# Altium schematic sheet mcu.SchDoc
size A4
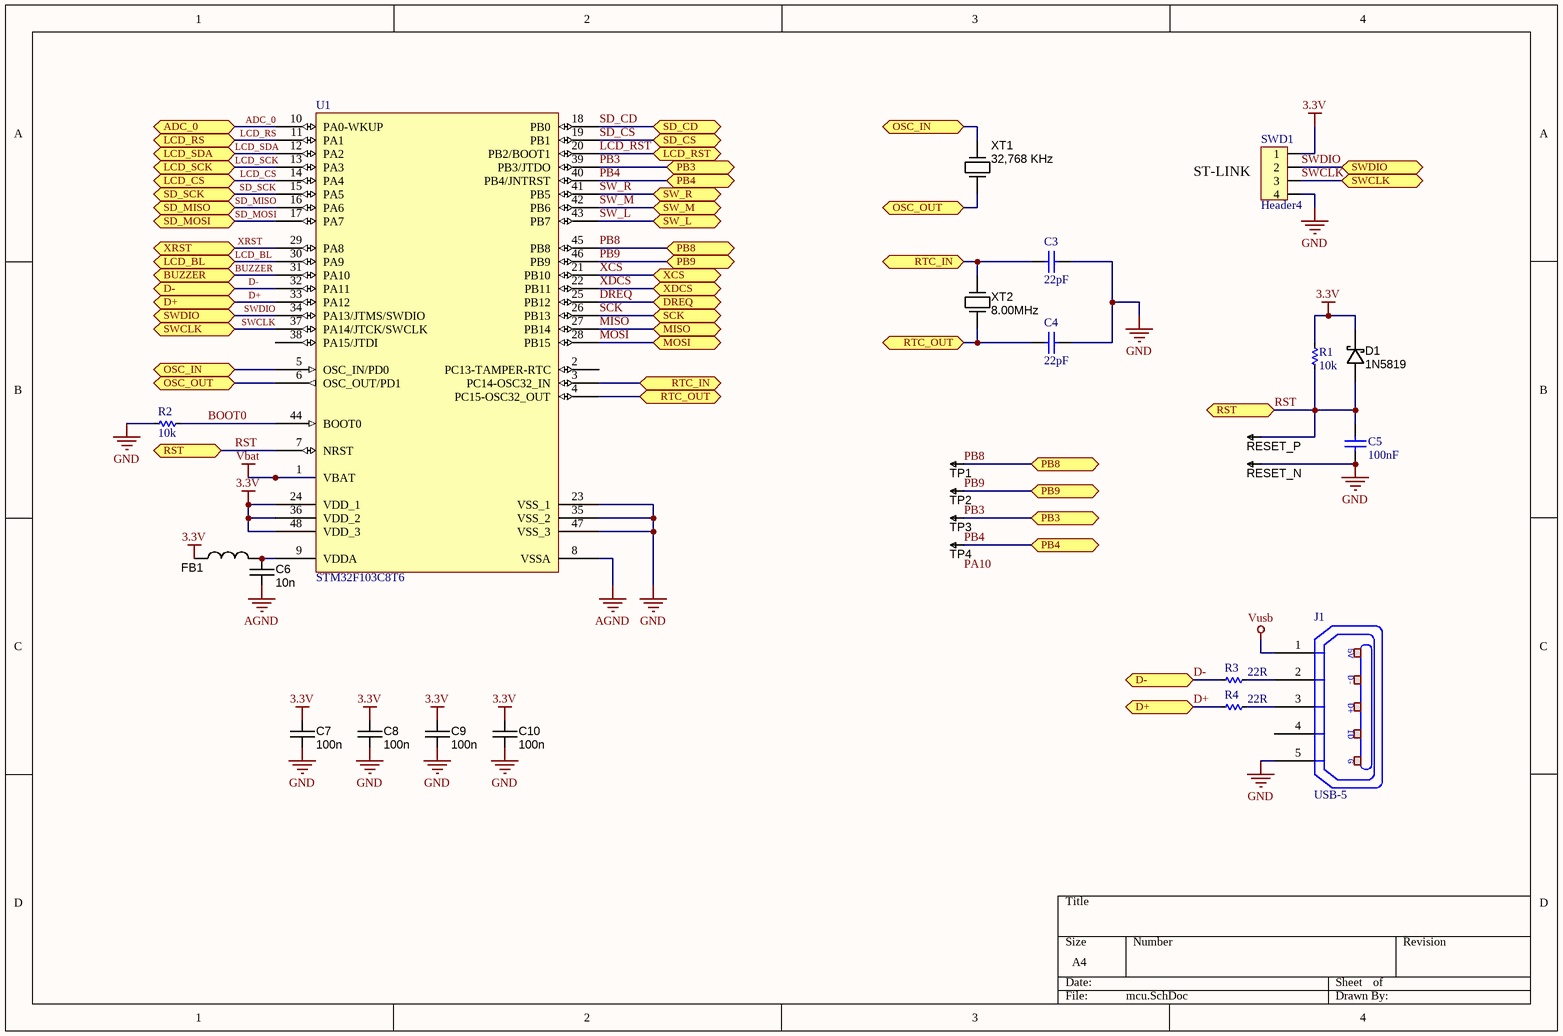
[diagram p0: mcu.SchDoc]

## Parts
C3  value 22pF  [C0805]  (hidden comment: Cap Semi)
C4  value 22pF  [C0805]  (hidden comment: Cap Semi)
C5  value 100nF  [C0805]  (hidden comment: Cap Semi)
C6  value 10n  [CAPC1608X90N]  (hidden comment: approved sub OK)
C7  value 100n  [CAPC1608X90N]  (hidden comment: approved sub OK)
C8  value 100n  [CAPC1608X90N]  (hidden comment: approved sub OK)
C9  value 100n  [CAPC1608X90N]  (hidden comment: approved sub OK)
C10  value 100n  [CAPC1608X90N]  (hidden comment: approved sub OK)
D1  Manufacturer Part Number 1: 1N5819  [SOD123]  (hidden comment: DIODE_SCHOTTKY_40V_1A)
FB1  2K2 @ 100 MHz  [FBC2012N]  (value not drawn)
J1  USB-5  [USB-M1]
R1  value 10k  [RES-SMD-0805]  (hidden comment: Res)
R2  value 10k  [RES-SMD-0603]  (hidden comment: Res)
R3  value 22R  [RES-SMD-0603]  (hidden comment: Res)
R4  value 22R  [RES-SMD-0603]  (hidden comment: Res)
RESET_N  TESTPOINT  [TP-R60]  (value not drawn)  (no BOM)
RESET_P  TESTPOINT  [TP-R60]  (value not drawn)  (no BOM)
SWD1  Header4  [HDR4]
TP1  TESTPOINT  [TP-R60]  (value not drawn)  (no BOM)
TP2  TESTPOINT  [TP-R60]  (value not drawn)  (no BOM)
TP3  TESTPOINT  [TP-R60]  (value not drawn)  (no BOM)
TP4  TESTPOINT  [TP-R60]  (value not drawn)  (no BOM)
U1  STM32F103C8T6  [LQFP48_N]
XT1  32,768 KHz  [CRYSTAL_CMR309T]
XT2  8.00MHz  [CRYSTAL_HC49-US-SM]

## Ports
ADC_0, BUZZER, D+, D-, DREQ, LCD_BL, LCD_CS, LCD_RS, LCD_RST, LCD_SCK, LCD_SDA, MISO, MOSI, OSC_IN, OSC_OUT, PB3, PB4, PB8, PB9, RST, RTC_IN, RTC_OUT, SCK, SD_CD, SD_CS, SD_MISO, SD_MOSI, SD_SCK, SW_L, SW_M, SW_R, SWCLK, SWDIO, XCS, XDCS, XRST

## Nets
3.3V: C7.1 C8.1 C9.1 C10.1 D1.K FB1.1 R1.1 SWD1.1 U1.24(VDD_1) U1.36(VDD_2) U1.48(VDD_3)
AGND: C6.2 U1.8(VSSA)
GND: C3.1 C4.1 C5.1 C7.2 C8.2 C9.2 C10.2 J1.5(P5) R2.2 RESET_N.1 SWD1.4 U1.23(VSS_1) U1.35(VSS_2) U1.47(VSS_3)
Vbat: U1.1(VBAT)
Vusb: J1.1(P1)
ADC_0: U1.10(PA0-WKUP) ; port ADC_0
BOOT0: R2.1 U1.44(BOOT0)
BUZZER: U1.31(PA10) ; port BUZZER
D+: R4.2 U1.33(PA12) ; port D+
D-: R3.2 U1.32(PA11) ; port D-
DREQ: U1.25(PB12) ; port DREQ
LCD_BL: U1.30(PA9) ; port LCD_BL
LCD_CS: U1.14(PA4) ; port LCD_CS
LCD_RS: U1.11(PA1) ; port LCD_RS
LCD_RST: U1.20(PB2/BOOT1) ; port LCD_RST
LCD_SCK: U1.13(PA3) ; port LCD_SCK
LCD_SDA: U1.12(PA2) ; port LCD_SDA
MISO: U1.27(PB14) ; port MISO
MOSI: U1.28(PB15) ; port MOSI
OSC_IN: U1.5(OSC_IN/PD0) XT1.2(OUT) ; port OSC_IN
OSC_OUT: U1.6(OSC_OUT/PD1) XT1.1(IN) ; port OSC_OUT
PB3: TP3.1 U1.39(PB3/JTDO) ; port PB3
PB4: TP4.1 U1.40(PB4/JNTRST) ; port PB4
PB8: TP1.1 U1.45(PB8) ; port PB8
PB9: TP2.1 U1.46(PB9) ; port PB9
RST: C5.2 D1.A R1.2 RESET_P.1 U1.7(NRST) ; port RST
RTC_IN: C3.2 U1.3(PC14-OSC32_IN) XT2.2(OUT) ; port RTC_IN
RTC_OUT: C4.2 U1.4(PC15-OSC32_OUT) XT2.1(IN) ; port RTC_OUT
SCK: U1.26(PB13) ; port SCK
SD_CD: U1.18(PB0) ; port SD_CD
SD_CS: U1.19(PB1) ; port SD_CS
SD_MISO: U1.16(PA6) ; port SD_MISO
SD_MOSI: U1.17(PA7) ; port SD_MOSI
SD_SCK: U1.15(PA5) ; port SD_SCK
SW_L: U1.43(PB7) ; port SW_L
SW_M: U1.42(PB6) ; port SW_M
SW_R: U1.41(PB5) ; port SW_R
SWCLK: SWD1.3 U1.37(PA14/JTCK/SWCLK) ; port SWCLK
SWDIO: SWD1.2 U1.34(PA13/JTMS/SWDIO) ; port SWDIO
XCS: U1.21(PB10) ; port XCS
XDCS: U1.22(PB11) ; port XDCS
XRST: U1.29(PA8) ; port XRST
NetC6_1: C6.1 FB1.2 U1.9(VDDA)
NetJ1_2: J1.2(P2) R3.1
NetJ1_3: J1.3(P3) R4.1

Not connected (* = marked no-connect by the designer): J1 4(P4); U1 2(PC13-TAMPER-RTC) 38(PA15/JTDI)

## Notes on the sheet
- (near SWD1) ST-LINK
- Labels drawn without touching a wire or pin: PA10
- (in symbol USB-5) 5V; D-; D+; ID; G

## Library data of the parts
C3-C5 = Cap Semi: Capacitor (Semiconductor SIM Model); Published: 8-Jun-2000; LatestRevisionDate: 29-May-2009; LatestRevisionNote: IPC-7351 Footprint Added.; PackageReference: C1206; Publisher: Altium Limited; PackageDescription: Chip Capacitor
C6-C10 = CAPC_100n_0603_X7R_50V_10%: Capacitor SMD Cer 100nF 10% 50V X7R 0603; Manufacturer 1: AVX Corporation; Manufacturer Part Number 1: 06035C104KAT2A; Ratings: 50V; X7R; Material: ceramic; SCDType: spec; Manufacturer 2: TDK Corporation; Manufacturer Part Number 2: C1608X7R1H104K; Package / Case: 0603 (1608 Metric); Tolerance: ±10%; Supplier 1: Digi-Key; Supplier Part Number 1: 478-5052-1-ND; ComponentLink1URL: http://www.avx.com/docs/Catalogs/cx7r.pdf; ComponentLink1Description: http://www.avx.com/docs/Catalogs/cx7r.pdf; Supplier 2: Digi-Key; Supplier Part Number 2: 445-1314-1-ND; ComponentLink2URL: http://product.tdk.com/capacitor/mlcc/en/documents/mlcc_commercial_general_en.pdf; ComponentLink2Description: http://product.tdk.com/capacitor/mlcc/en/documents/mlcc_commercial_general_en.pdf
D1 = DIODE_SCHOTTKY_40V_1A: Diode Schottky SMD 40V 1A SOD123; Manufacturer 1: Diodes Inc; Ratings: 40V; 1A; Material: Si; SCDType: spec; Package / Case: SOD123; Diode Type: Schottky; Mounting Type: Surface Mount; Supplier 1: Digi-Key; Supplier Part Number 1: 1N5819HW-FDICT-ND
FB1 = FERRITE_2K2-100MHz_0805: Ferrite bead 2.2K Ohm at 100 MHz 200mA 0805 SMD; Manufacturer 1: Laird-Signal Integrity Products; Manufacturer Part Number 1: HZ0805B222R-10; Ratings: 200 mA; 800 mOhm DC; Impedance @ Frequency: 600 Ohm @ 100MHz; DC Resistance (DCR): 800 mOhm Max; Filter Type: Differential Mode - Single; SCDType: source; Size / Dimension: 0.063" L x 0.031" W (1.60mm x 0.80mm); Current Rating: 200mA; Package / Case: 0805 (2012 Metric); Height (Max): 0.043" (1.09mm); ComponentLink1URL: http://www.lairdtech.com/WorkArea/linkit.aspx?LinkIdentifier=id&ItemID=4879; ComponentLink1Description: http://www.lairdtech.com/WorkArea/linkit.aspx?LinkIdentifier=id&ItemID=4879; Supplier 1: Digi-Key; Supplier Part Number 1: 240-2562-1-ND; Mounting Type: Surface Mount; Value: 2K2 @ 100 MHz
J1 = USB-5: Manufacturer: FCI; Manufacturer Part Number: 10118193-0001LF; Connector Type: USB - micro B; Number of Contacts: 5; Gender: Receptacle; Specifications: USB 2.0; .Creator: MM; .Checked PCB: RF; Supplier 1: Digi-Key; RoHS: RoHS Compliant; Category: Connectors, Interconnects; Stock 1: 28642; Pricing 1: 1=0.46, 10=0.433, 25=0.3712, 50=0.3156, 100=0.3032, 250=0.27224, 500=0.25988 (USD); Packaging: Cut Tape (CT); Mounting Type: Surface Mount, Right Angle, Horizontal; Features: Shielded, Solder Retention; Ingress Protection: -; ComponentLink1URL: http://portal.fciconnect.com/Comergent//fci/drawing/10118193.pdf; ComponentLink1Description: http://portal.fciconnect.com/Comergent//fci/drawing/10118193.pdf; Supplier Part Number 1: 609-4616-1-ND; .Checked SCH: MM
R1-R4 = Res-SMD: Resistor; Manufacturer: Generic Components; Class: Passive; Published: 08/06/2000; Publisher: Altium Hobart Technology Centre
RESET_N RESET_P TP1-TP4 = TESTPOINT: SMD test pin
SWD1 = Header4: Header IDC, 4 x 1 Pin Vertical 2.54mm Pitch (Non-Boxed, Male); Manufacturer: W¨¹rth Elektronik eiSos GmbH; partNo: 613002143121; ComponentLink1 Description: Manufacturer; ComponentLink2 Description: Datasheet; NoPins: 02; Created Date: 29 March 2013; ComponentLink1URL: http://www.we-online.com; ComponentLink2URL: http://katalog.we-online.de/em/datasheet/6130xx143121.pdf; Created by: Karrer Zheng
U1 = STM32F103C8T6: STM32 ARM-based 32-bit MCU with 64 Kbytes Flash, 48-pin LQFP, Industrial Temperature; Published: 30-May-2008; DatasheetVersion: rev6, Mar-2008; PackageVersion: Mar-2008; PackageReference: LQFP48; Publisher: Altium Limited; PackageDescription: 48-Pin Low-Profile Quad Flat Pack, 7 x 7 mm Body, 0.5 mm Pitch (LQFP48); ComponentLink1Description: Manufacturer Link; ComponentLink1URL: www.st.com/stm32; ComponentLink2Description: Datasheet; ComponentLink2URL: http://www.st.com/stonline/products/literature/ds/13587.pdf
XT1 = Crystal_6MHz_CMR309T: Resonator Ceramic 6.00 MHz 30ppm; Manufacturer 1: Citizen Finetech Miyota; Manufacturer Part Number 1: CMR309T-6.000MABJ-UT; Frequency: 6MHz; Frequency Stability: ±50ppm; Load Capacitance: 18pF; Operating Mode: Fundamental; SCDType: spec; Package / Case: Cylindrical Can, Radial; Ratings: 6.00 MHz; Type: MHz Crystal; Frequency Tolerance: ±30ppm; Operating Temperature: -10°C ~ 60°C; Mounting Type: Surface Mount; Size / Dimension: 0.118" Dia x 0.346" L (3.00mm x 8.80mm); Height: 0.122" (3.10mm); Supplier 1: Digi-Key; Supplier Part Number 1: 300-8348-1-ND; Tolerance: ±50ppm; ComponentLink1URL: http://media.digikey.com/pdf/Data%20Sheets/Citizen%20PDFs/CMR310T%20CMR309T.pdf; ComponentLink1Description: http://media.digikey.com/pdf/Data%20Sheets/Citizen%20PDFs/CMR310T%20CMR309T.pdf; Value: 32,768 KHz
XT2 = Crystal_6MHz_HC49/US: Resonator Ceramic 6.00 MHz 30ppm; Manufacturer 1: CTS-Frequency Controls; Manufacturer Part Number 1: ATS060BSM-1; Frequency: 6MHz; Frequency Stability: ±50ppm; Load Capacitance: 18pF; Operating Mode: Fundamental; Parameter Name: 0.169" (4.30mm); SCDType: spec; Package / Case: HC49/US-SM; Ratings: 6.00 MHz; Supplier 1: Digi-Key; Supplier Part Number 1: CTX882CT-ND; Type: MHz Crystal; Frequency Tolerance: ±30ppm; Operating Temperature: -20°C ~ 70°C; Mounting Type: Surface Mount; Size / Dimension: 0.437" L x 0.190" W (11.10mm x 4.83mm); ComponentLink1URL: http://www.ctscorp.com/components/Datasheets/008-0309-0.pdf; ComponentLink1Description: http://www.ctscorp.com/components/Datasheets/008-0309-0.pdf